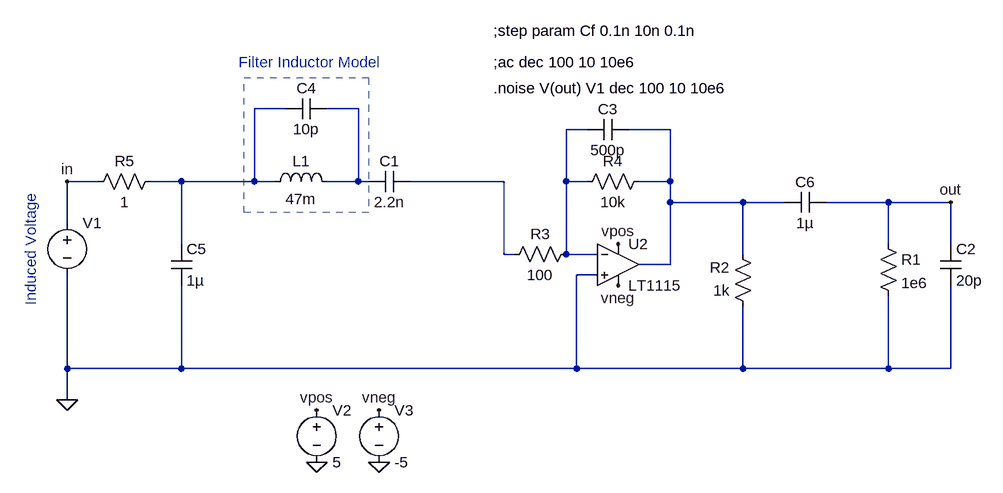
[diagram p0: schematic initial_bandpass_experimental.asc]
initial_bandpass_experimental.asc, the LTspice schematic file:
Version 4
SHEET 1 880 680
WIRE -560 0 -608 0
WIRE -448 0 -496 0
WIRE -96 32 -128 32
WIRE 32 32 -32 32
WIRE -848 112 -896 112
WIRE -720 112 -768 112
WIRE -608 112 -608 0
WIRE -608 112 -720 112
WIRE -576 112 -608 112
WIRE -448 112 -448 0
WIRE -448 112 -496 112
WIRE -432 112 -448 112
WIRE -224 112 -368 112
WIRE -128 112 -128 32
WIRE -96 112 -128 112
WIRE 32 112 32 32
WIRE 32 112 -16 112
WIRE 32 144 32 112
WIRE 144 144 32 144
WIRE 208 144 144 144
WIRE 368 144 272 144
WIRE 464 144 368 144
WIRE -896 176 -896 112
WIRE -720 208 -720 112
WIRE 368 208 368 144
WIRE 464 208 464 144
WIRE -224 224 -224 112
WIRE -208 224 -224 224
WIRE -128 224 -128 112
WIRE -80 224 -128 224
WIRE 144 224 144 144
WIRE 32 240 32 144
WIRE 32 240 -16 240
WIRE -80 256 -112 256
WIRE -896 400 -896 256
WIRE -720 400 -720 272
WIRE -720 400 -896 400
WIRE -112 400 -112 256
WIRE -112 400 -720 400
WIRE 144 400 144 304
WIRE 144 400 -112 400
WIRE 368 400 368 288
WIRE 368 400 144 400
WIRE 464 400 464 272
WIRE 464 400 368 400
WIRE -896 448 -896 400
FLAG -512 544 0
FLAG -416 544 0
FLAG -512 464 vpos
FLAG -416 464 vneg
FLAG -48 272 vneg
FLAG -48 208 vpos
FLAG 464 144 out
FLAG -896 112 in
FLAG -896 448 0
SYMBOL voltage -896 160 R0
WINDOW 39 0 0 Left 0
SYMATTR InstName V1
SYMATTR Value ""
SYMATTR Value2 AC 100n 0
SYMBOL cap -368 96 R90
WINDOW 0 0 32 VBottom 2
WINDOW 3 32 32 VTop 2
SYMATTR InstName C1
SYMATTR Value 2.2n
SYMBOL res 352 192 R0
SYMATTR InstName R1
SYMATTR Value 1e6
SYMBOL cap 448 208 R0
SYMATTR InstName C2
SYMATTR Value 20p
SYMBOL res 160 320 R180
WINDOW 0 36 76 Left 2
WINDOW 3 36 40 Left 2
SYMATTR InstName R2
SYMATTR Value 1k
SYMBOL res -112 208 R90
WINDOW 0 0 56 VBottom 2
WINDOW 3 32 56 VTop 2
SYMATTR InstName R3
SYMATTR Value 100
SYMBOL res 0 96 R90
WINDOW 0 0 56 VBottom 2
WINDOW 3 32 56 VTop 2
SYMATTR InstName R4
SYMATTR Value 10k
SYMBOL voltage -512 448 R0
WINDOW 123 0 0 Left 0
WINDOW 39 0 0 Left 0
SYMATTR InstName V2
SYMATTR Value 5
SYMBOL voltage -416 448 R0
WINDOW 123 0 0 Left 0
WINDOW 39 0 0 Left 0
SYMATTR InstName V3
SYMATTR Value -5
SYMBOL ind -592 128 R270
WINDOW 0 32 56 VTop 2
WINDOW 3 5 56 VBottom 2
SYMATTR InstName L1
SYMATTR Value 47m
SYMATTR SpiceLine Rser=200
SYMBOL Opamps\\LT1115 -48 176 R0
SYMATTR InstName U2
SYMBOL cap -32 16 R90
WINDOW 0 0 32 VBottom 2
WINDOW 3 32 32 VTop 2
SYMATTR InstName C3
SYMATTR Value 500p
SYMBOL cap -496 -16 R90
WINDOW 0 0 32 VBottom 2
WINDOW 3 32 32 VTop 2
SYMATTR InstName C4
SYMATTR Value 10p
SYMBOL res -752 96 R90
WINDOW 0 0 56 VBottom 2
WINDOW 3 32 56 VTop 2
SYMATTR InstName R5
SYMATTR Value 1
SYMBOL cap -736 208 R0
SYMATTR InstName C5
SYMATTR Value 1µ
SYMBOL cap 272 128 R90
WINDOW 0 0 32 VBottom 2
WINDOW 3 32 32 VTop 2
SYMATTR InstName C6
SYMATTR Value 1µ
TEXT -240 -72 Left 2 !;ac dec 100 10 10e6
TEXT -952 128 VRight 2 ;Induced Voltage
TEXT -240 -32 Left 2 !.noise V(out) V1 dec 100 10 10e6
TEXT -240 -120 Left 2 !;step param Cf 0.1n 10n 0.1n
TEXT -632 -72 Left 2 ;Filter Inductor Model
RECTANGLE Normal -432 160 -624 -48 2

The netlist it stands for:
* initial_bandpass_experimental.asc
V1 in 0 AC 100n 0
C1 N005 N002 2.2n
R1 out 0 1e6
C2 out 0 20p
R2 0 N004 1k
R3 N003 N005 100
R4 N004 N003 10k
V2 vpos 0 5
V3 vneg 0 -5
L1 N001 N002 47m Rser=200
XU2 0 N003 vpos vneg N004 LT1028  ; LT1115, pins In+ In- V+ V- OUT
C3 N004 N003 500p
C4 N002 N001 10p
R5 N001 in 1
C5 N001 0 1µ
C6 out N004 1µ
;ac dec 100 10 10e6
* Induced Voltage
.noise V(out) V1 dec 100 10 10e6
;step param Cf 0.1n 10n 0.1n
* Filter Inductor Model
.lib LTC.lib
.backanno
.end